# EAGLE design aurora-halo (EAGLE 9.2.2)
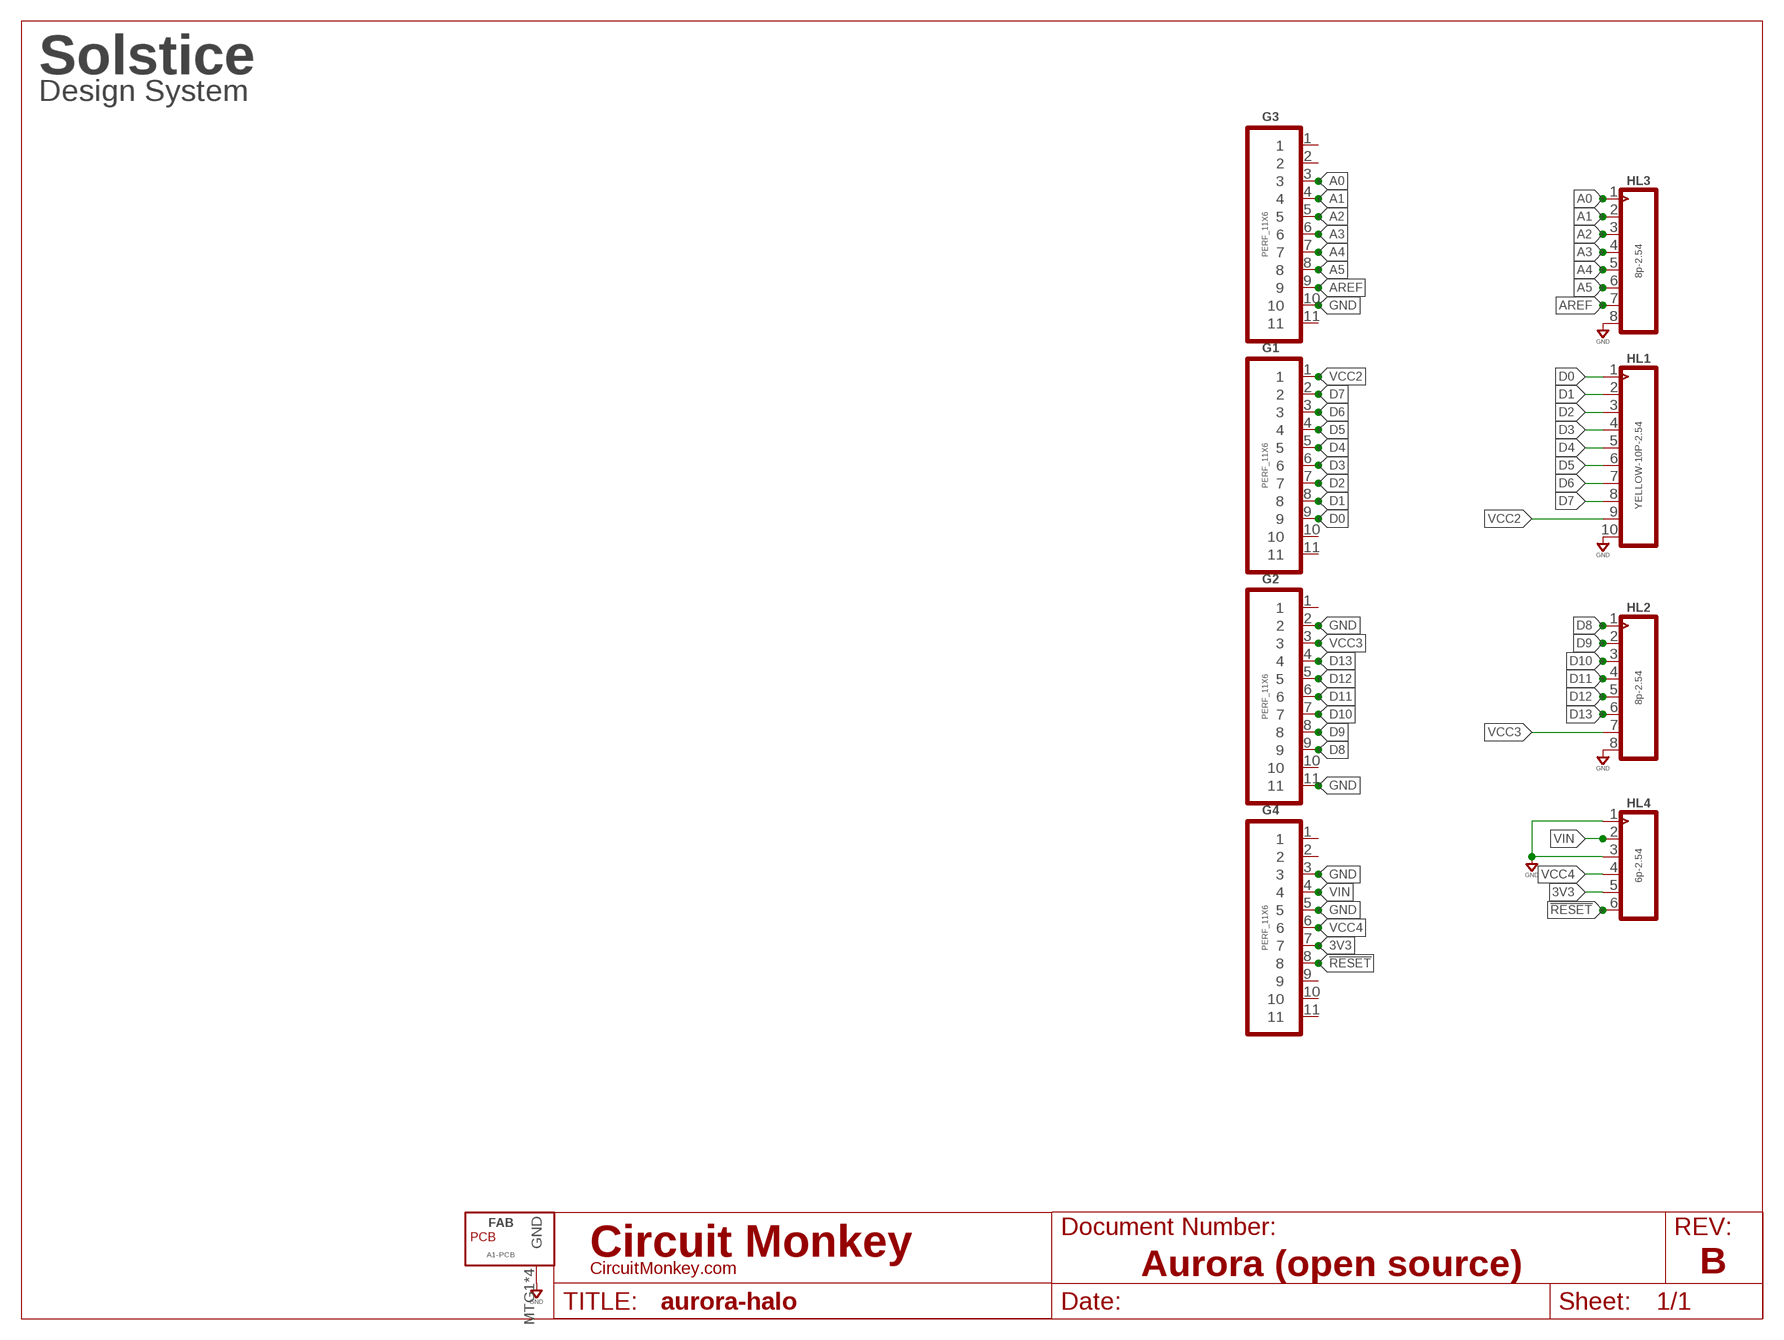
[diagram p0: schematic, sheet 1]
U$1 (LETTER_L-CIRCUITMONKEY): DOCUMENT_NUMBER: Aurora (open source); REV: B

## Parts
FAB  A1-PCB  PCB-4-MTG-HALO-A1  [PCB-HALO-A1]
G1  PERF_11X6  [PERF_6X11]
G2  PERF_11X6  [PERF_6X11]
G3  PERF_11X6  [PERF_6X11]
G4  PERF_11X6  [PERF_6X11]
HL1  YELLOW-10P-2.54  DIP-YELLOW-FEMALE-HEADER-VERT(10P-2.54)  [H10-2.54]
HL2  8p-2.54  DIP-BLACK-FEMALE-HEADER-VERT(8P-2.54)  [H8-2.54]
HL3  8p-2.54  DIP-BLACK-FEMALE-HEADER-VERT(8P-2.54)  [H8-2.54]
HL4  6p-2.54  DIP-BLACK-FEMALE-HEADER-VERT(6P-2.54)  [H6-2.54]

## Nets
3V3: G4.7 HL4.5
!RESET: G4.8 HL4.6
A0: G3.3 HL3.1
A1: G3.4 HL3.2
A2: G3.5 HL3.3
A3: G3.6 HL3.4
A4: G3.7 HL3.5
A5: G3.8 HL3.6
AREF: G3.9 HL3.7
D0: G1.9 HL1.1
D1: G1.8 HL1.2
D2: G1.7 HL1.3
D3: G1.6 HL1.4
D4: G1.5 HL1.5
D5: G1.4 HL1.6
D6: G1.3 HL1.7
D7: G1.2 HL1.8
D8: G2.9 HL2.1
D9: G2.8 HL2.2
D10: G2.7 HL2.3
D11: G2.6 HL2.4
D12: G2.5 HL2.5
D13: G2.4 HL2.6
GND: FAB.MTG1(GND) FAB.MTG2(GND) FAB.MTG3(GND) FAB.MTG4(GND) G2.2 G2.11 G3.10 G4.3 G4.5 HL1.10 HL2.8 HL3.8 HL4.1 HL4.3
VCC2: G1.1 HL1.9
VCC3: G2.3 HL2.7
VCC4: G4.6 HL4.4
VIN: G4.4 HL4.2
Unconnected: G1.10 G1.11 G2.1 G2.10 G3.1 G3.2 G3.11 G4.1 G4.2 G4.9 G4.10 G4.11

## Notes on the sheet
- Solstice
- Design System

## Library data of the parts
FAB = solstice-design-system:PCB-4-MTG: PCBs with 4 mounting holes
G1-G4 = perf-surf:PERF_11X?
HL1 = Seeed-Connector:DIP-YELLOW-FEMALE-HEADER-VERT(10P-2.54): 320030059; MPN: F185-1110A1BSYC1
HL2 HL3 = Seeed-Connector:DIP-BLACK-FEMALE-HEADER-VERT(8P-2.54): 320030061; MPN: F185-1108A1BSYC1
HL4 = Seeed-Connector:DIP-BLACK-FEMALE-HEADER-VERT(6P-2.54): 320030060; MPN: F185-1106A1BSYC1

## Board
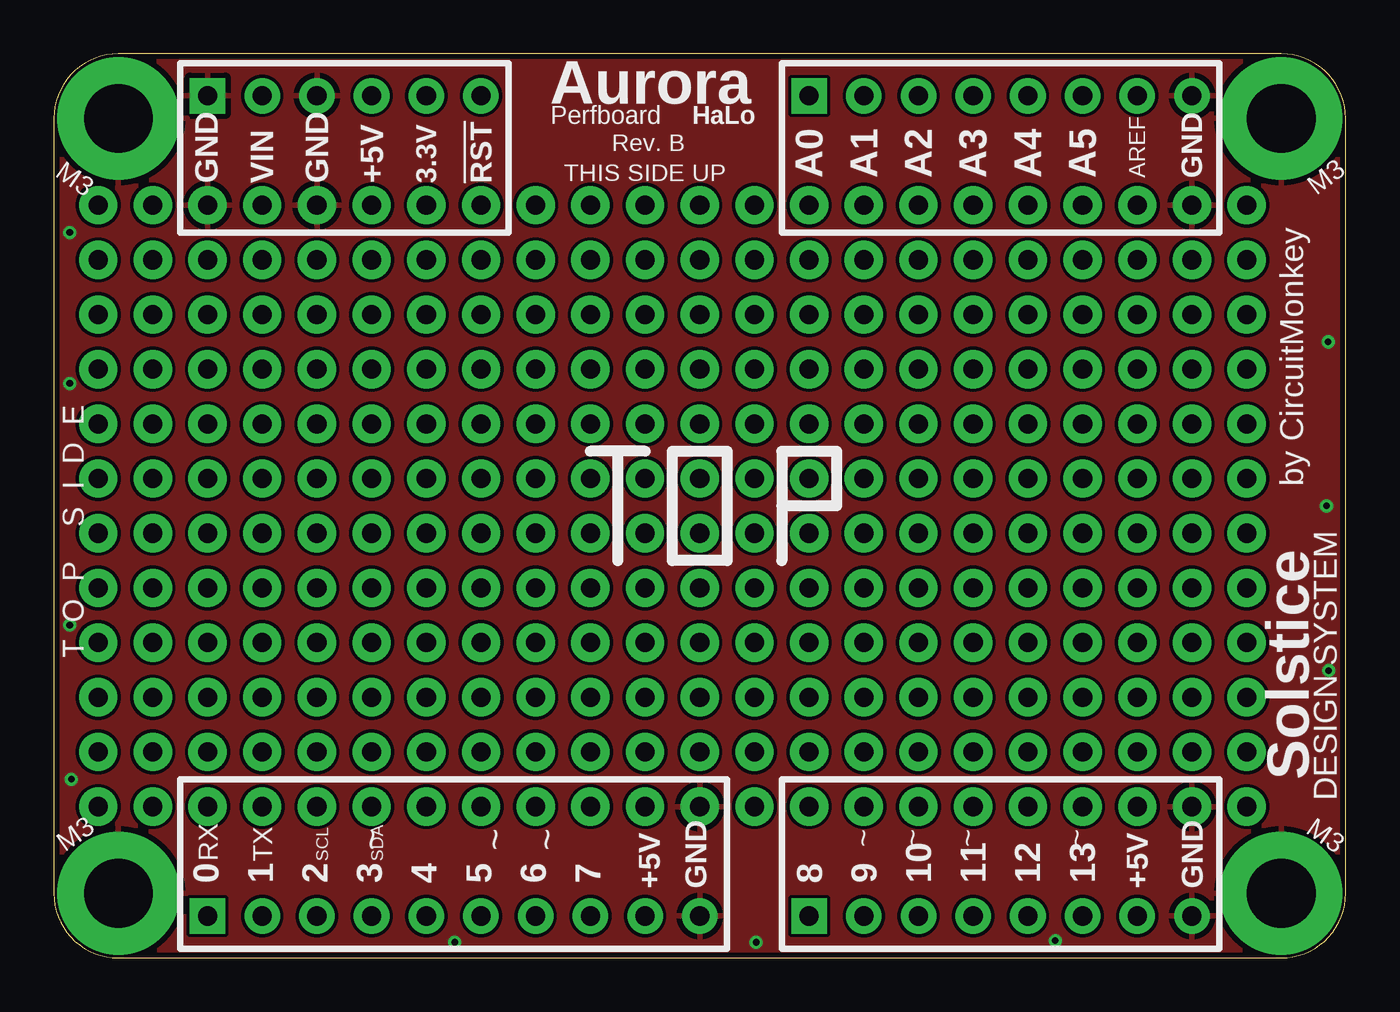
[diagram p1: board, top side]
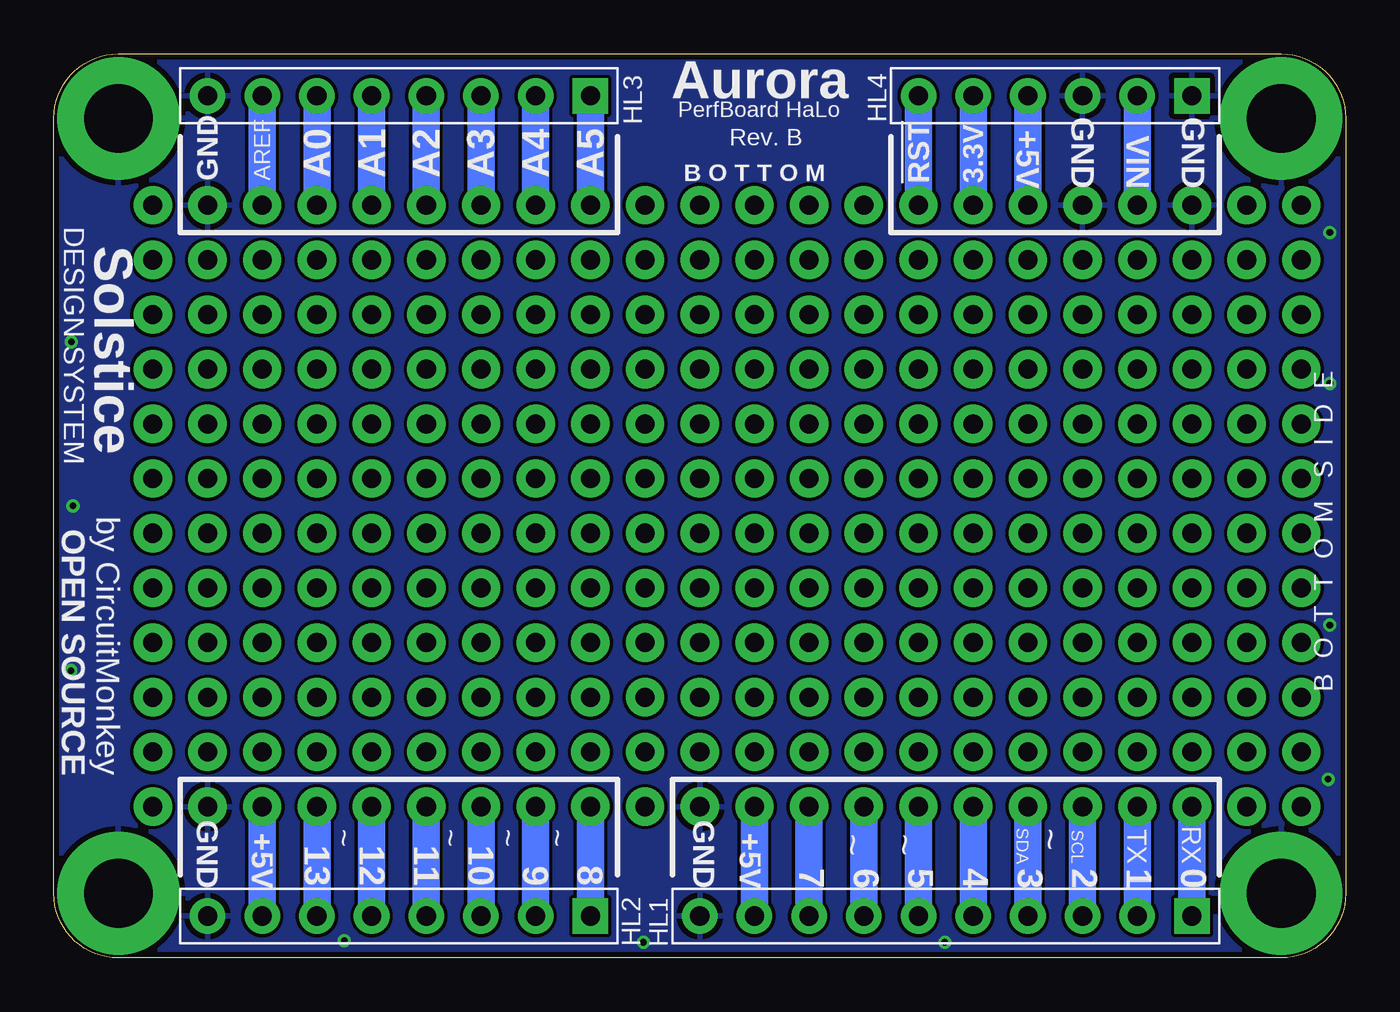
[diagram p2: board, bottom side, seen from below]

Size 60 x 42 mm. Coordinates in mm from the lower left corner, seen from the top.
Copper layers (1*16): Top 0.035mm / dielectric 1.5mm / Bottom 0.035mm
Design rules "SeeedStudio_2layer_2018_marks": minimum track width 6mil, minimum drill 12mil, track to track 6mil, track to pad 6mil, pad to pad 6mil, via to via 6mil, smd to smd 0mil, copper to edge 10mil, drill to drill 10mil, minimum pad ring 10mil, minimum via ring 6mil, stop-mask expansion 2mil, vias tented up to drill 100mil, thermal gap 10mil

### Footprints (pad centres in the part's own frame; a part is rotated, then mirrored left to right if it is on the bottom)
PCB-HALO-A1 = drill 3.2 pad 5.7: MTG1 -27,-18; MTG2 -27,18; MTG3 27,18; MTG4 27,-18
PERF_6X11 = drill 0.889 pad 1.778: 1 -12.7,6.35; 2 -10.16,6.35; 3 -7.62,6.35; 4 -5.08,6.35; 5 -2.54,6.35; 6 0,6.35; 7 2.54,6.35; 8 5.08,6.35; 9 7.62,6.35; 10 10.16,6.35; 11 12.7,6.35; 12 -12.7,3.81; 13 -10.16,3.81; 14 -7.62,3.81; 15 -5.08,3.81; 16 -2.54,3.81; 17 0,3.81; 18 2.54,3.81; 19 5.08,3.81; 20 7.62,3.81; 21 10.16,3.81; 22 12.7,3.81; 23 -12.7,1.27; 24 -10.16,1.27; 25 -7.62,1.27; 26 -5.08,1.27; 27 -2.54,1.27; 28 0,1.27; 29 2.54,1.27; 30 5.08,1.27; 31 7.62,1.27; 32 10.16,1.27; 33 12.7,1.27; 34 -12.7,-1.27; 35 -10.16,-1.27; 36 -7.62,-1.27; 37 -5.08,-1.27; 38 -2.54,-1.27; 39 0,-1.27; 40 2.54,-1.27; 41 5.08,-1.27; 42 7.62,-1.27; 43 10.16,-1.27; 44 12.7,-1.27; 45 -12.7,-3.81; 46 -10.16,-3.81; 47 -7.62,-3.81; 48 -5.08,-3.81; 49 -2.54,-3.81; 50 0,-3.81; 51 2.54,-3.81; 52 5.08,-3.81; 53 7.62,-3.81; 54 10.16,-3.81; 55 12.7,-3.81; 56 -12.7,-6.35; 57 -10.16,-6.35; 58 -7.62,-6.35; 59 -5.08,-6.35; 60 -2.54,-6.35; 61 0,-6.35; 62 2.54,-6.35; 63 5.08,-6.35; 64 7.62,-6.35; 65 10.16,-6.35; 66 12.7,-6.35
H10-2.54 = drill 0.889 pad 1.651 square: 1 0,11.43 | drill 0.889 pad 1.651: 2 0,8.89; 3 0,6.35; 4 0,3.81; 5 0,1.27; 6 0,-1.27; 7 0,-3.81; 8 0,-6.35; 9 0,-8.89; 10 0,-11.43
H8-2.54 = drill 0.889 pad 1.651 square: 1 0,8.89 | drill 0.889 pad 1.651: 2 0,6.35; 3 0,3.81; 4 0,1.27; 5 0,-1.27; 6 0,-3.81; 7 0,-6.35; 8 0,-8.89
H6-2.54 = drill 0.889 pad 1.651 square: 1 0,6.35 | drill 0.889 pad 1.651: 2 0,3.81; 3 0,1.27; 4 0,-1.27; 5 0,-3.81; 6 0,-6.35

### Placement (x,y rotation side)
FAB  30,21 0 top
G1  14.76,13.38 180 top
G2  42.7,13.38 180 top
G3  42.7,28.62 0 top
G4  14.76,28.62 0 top
HL1  18.57,1.95 270 bottom
HL2  43.97,1.95 270 bottom
HL3  43.97,40.05 270 bottom
HL4  13.49,40.05 270 bottom

### Tracks (layer width: path | path; a pad name or v marks a point on that pad's centre or on a via)
3V3
  Bottom 1.27: HL4.5 G4.7
!RESET
  Bottom 1.27: HL4.6 G4.8
A0
  Bottom 1.27: G3.3 HL3.1
A1
  Bottom 1.27: G3.4 HL3.2
A2
  Bottom 1.27: G3.5 HL3.3
A3
  Bottom 1.27: G3.6 HL3.4
A4
  Bottom 1.27: G3.7 HL3.5
A5
  Bottom 1.27: G3.8 HL3.6
AREF
  Bottom 1.27: G3.9 HL3.7
D0
  Bottom 1.27: HL1.1 G1.9
D1
  Bottom 1.27: HL1.2 G1.8
D2
  Bottom 1.27: HL1.3 G1.7
D3
  Bottom 1.27: HL1.4 G1.6
D4
  Bottom 1.27: HL1.5 G1.5
D5
  Bottom 1.27: HL1.6 G1.4
D6
  Bottom 1.27: HL1.7 G1.3
D7
  Bottom 1.27: HL1.8 G1.2
D8
  Bottom 1.27: HL2.1 G2.9
D9
  Bottom 1.27: HL2.2 G2.8
D10
  Bottom 1.27: HL2.3 G2.7
D11
  Bottom 1.27: HL2.4 G2.6
D12
  Bottom 1.27: HL2.5 G2.5
D13
  Bottom 1.27: HL2.6 G2.4
GND  (via drill 0.3)
  other vias: 18.62,0.73 0.82,8.3 0.74,15.46 0.74,26.69 0.74,33.7 32.62,0.73 46.51,0.81 59.11,21 59.21,13.35 59.18,28.62
  pour Top (rank 5): 0,0 60,0 60,42 0,42
  pour Bottom (rank 5): 0,0 60,0 60,42 0,42
VCC2
  Bottom 1.27: HL1.9 G1.1
VCC3
  Bottom 1.27: HL2.7 G2.3
VCC4
  Bottom 1.27: HL4.4 G4.6
VIN
  Bottom 1.27: HL4.2 G4.4

### Text on the board
tPlace: Aurora | Perfboard | HaLo | Rev. B | THIS SIDE UP | by CircuitMonkey | T O P S I D E | Solstice | DESIGN SYSTEM
bPlace: Aurora | PerfBoard HaLo | Rev. B | B O T T O M | Solstice | DESIGN SYSTEM | B O T T O M S I D E | by CircuitMonkey | OPEN SOURCE